# Altium schematic sheet DevKitSTM_r1.SchDoc
size A2; PageSetup: Record=PageOptions|CenterHorizontal=True|CenterVertical=True|PrintScale=0.52|XCorrection=1.00|YCorrection=1.00|PrintKind=1|BorderSize=5000000|LeftOffset=0|BottomOffset=0|Orientation=2|PaperLength=1000|PaperWidth=1000|Scale=100|PaperSource=7|PrintQuality=600|MediaType=1|DitherType=10|PaperKind=A4|PrintScaleMode=1
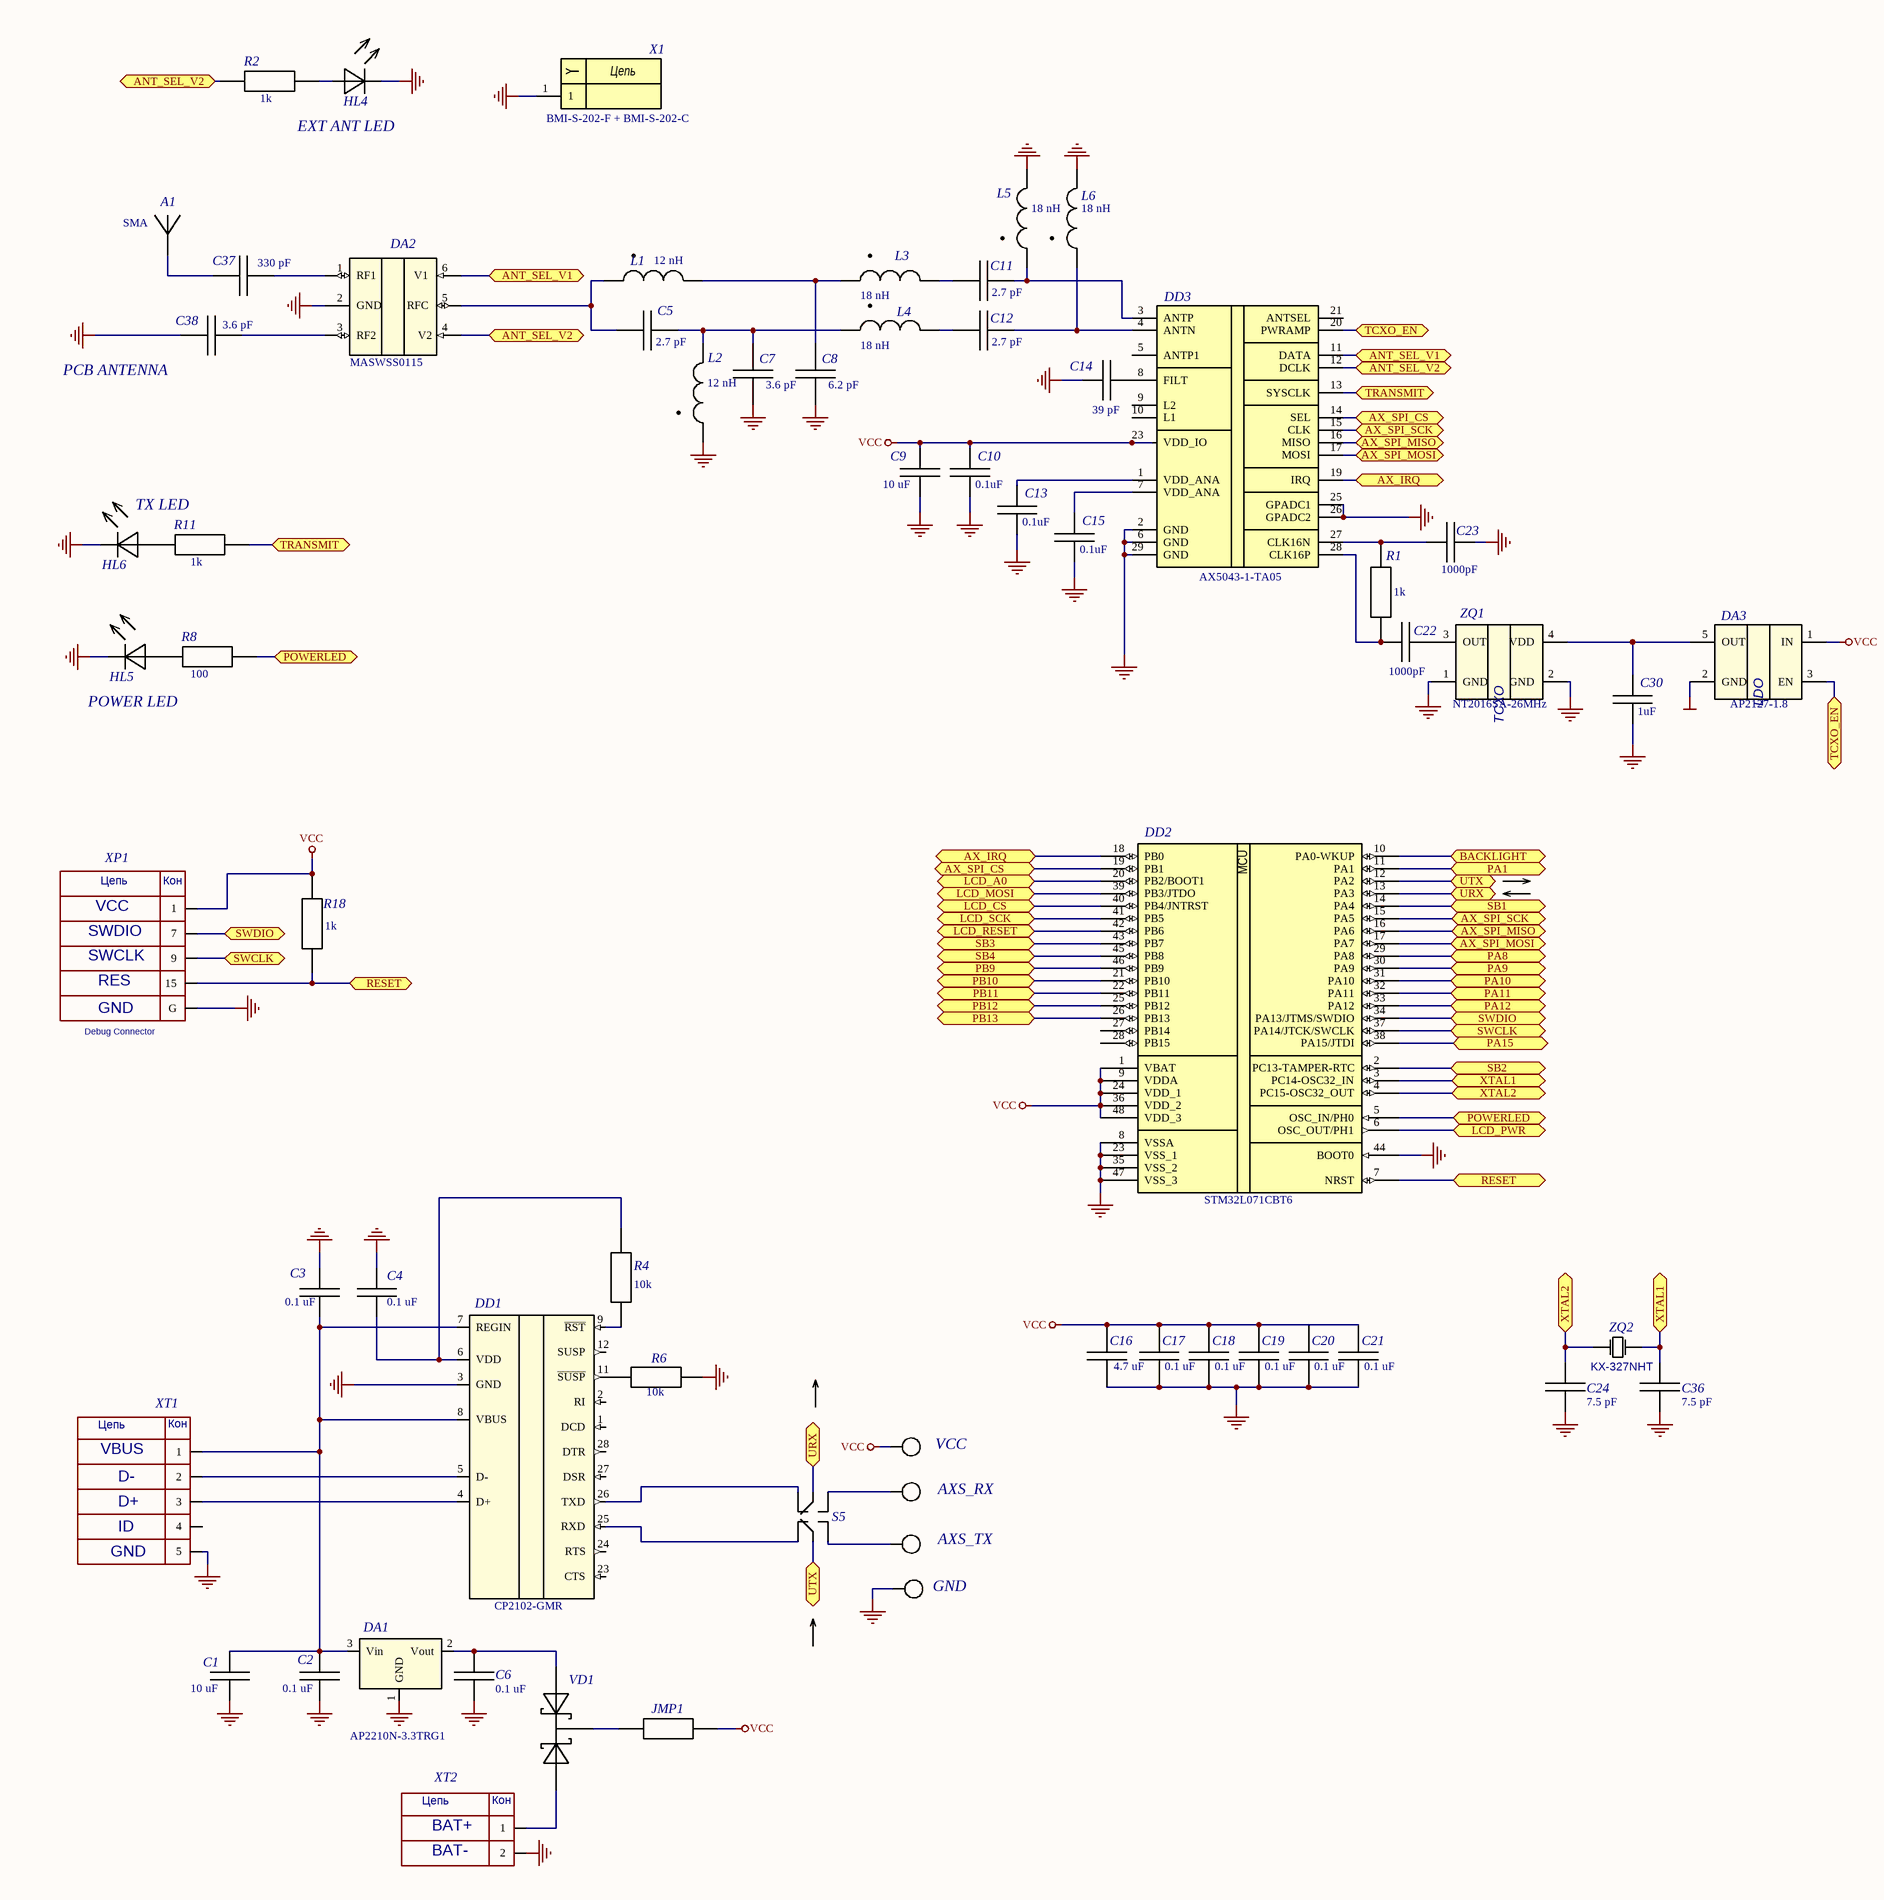
[diagram p0: DevKitSTM_r1.SchDoc, left]
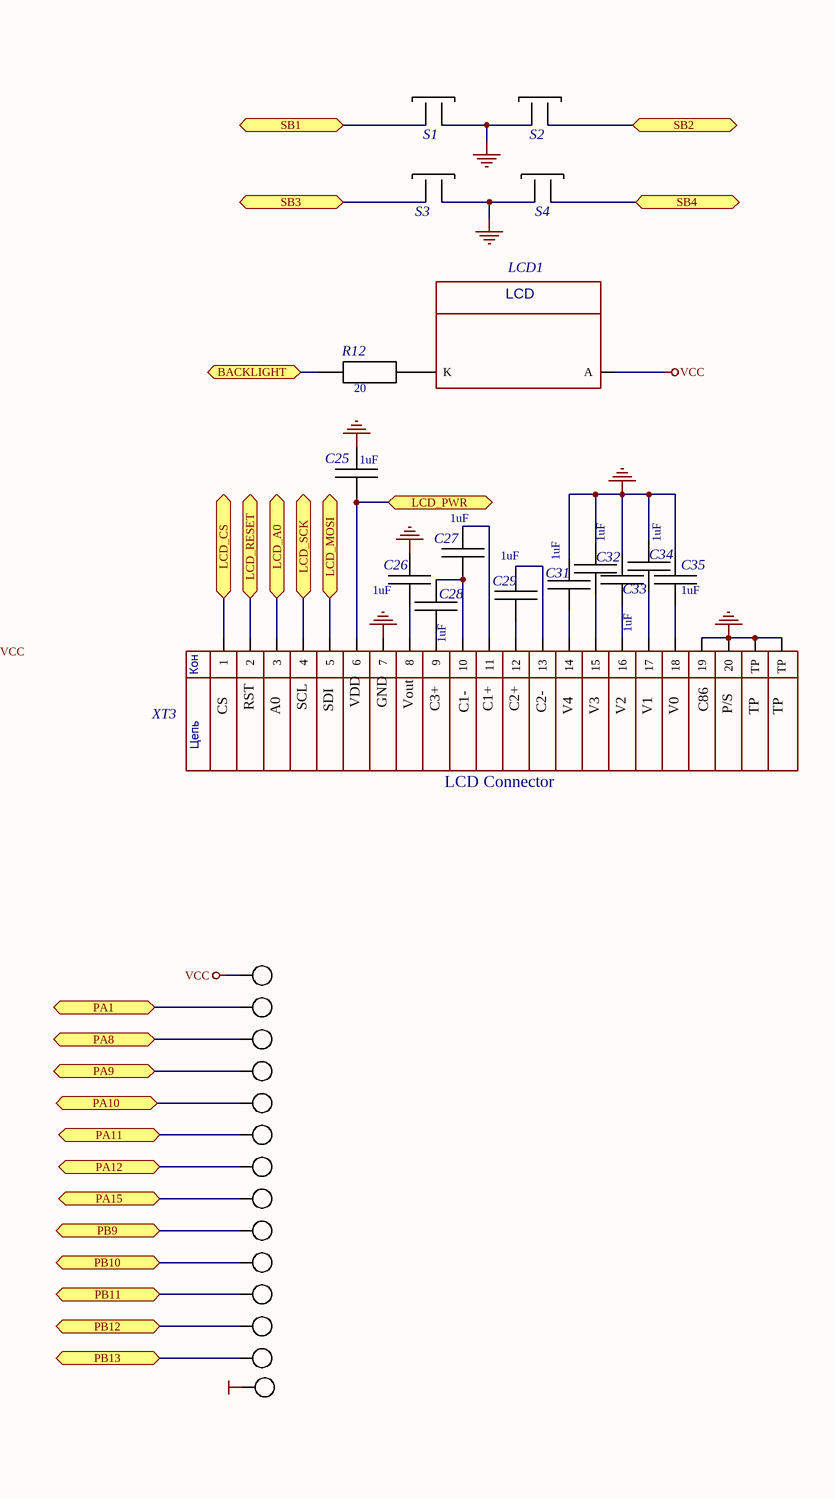
[diagram p1: DevKitSTM_r1.SchDoc, right]

## Parts
A1  SMA  [SMA_Str]  (net tie, no BOM)
C1  10 uF  [Cap_1206]
C2  0.1 uF  [Cap_0603]
C3  0.1 uF  [Cap_0603]
C4  0.1 uF  [Cap_0603]
C5  value 2.7 pF  [CAP_0603]
C6  0.1 uF  [Cap_0603]
C7  value 3.6 pF  [CAP_0603]
C8  value 6.2 pF  [CAP_0603]
C9  10 uF  [Cap_1206]
C10  0.1uF  [Cap_0603]
C11  value 2.7 pF  [CAP_0603]
C12  value 2.7 pF  [CAP_0603]
C13  0.1uF  [Cap_0603]
C14  39 pF  [Cap_0603]
C15  0.1uF  [Cap_0603]
C16  value 4.7 uF  [CAP_0603]
C17  value 0.1 uF  [CAP_0603]
C18  value 0.1 uF  [CAP_0603]
C19  value 0.1 uF  [CAP_0603]
C20  value 0.1 uF  [CAP_0603]
C21  value 0.1 uF  [CAP_0603]
C22  1000pF  [Cap_0603]
C23  1000pF  [Cap_0603]
C24  7.5 pF  [Cap_0603]
C25  1uF  [Cap_0603]
C26  1uF  [Cap_0603]
C27  1uF  [Cap_0603]
C28  1uF  [Cap_0603]
C29  1uF  [Cap_0603]
C30  1uF  [Cap_0603]
C31  1uF  [Cap_0603]
C32  1uF  [Cap_0603]
C33  1uF  [Cap_0603]
C34  1uF  [Cap_0603]
C35  1uF  [Cap_0603]
C36  7.5 pF  [Cap_0603]
C37  value 330 pF  [CAP_0603]
C38  value 3.6 pF  [CAP_0603]
DA1  PartNumber: AP2210N-3.3TRG1  [SOT23_L]  (hidden comment: AP2210)
DA2  MASWSS0115  [SC-70]
DA3  AP2127-1.8  [SOT23-5AN]
DD1  PartNumber: CP2102-GMR  [QFN28]  (hidden comment: CP2102)
DD2  STM32L071CBT6  [TSQFP50P900X900X160-48N]
DD3  AX5043-1-TA05  [QFN28]
HL4  LED_0603  [led0603]  (value not drawn)
HL5  LED_0603  [led0603]  (value not drawn)
HL6  LED_0603  [led0603]  (value not drawn)
JMP1  STD_RES  [JMP_PCB]  (value not drawn)  (no BOM)
L1  value 12 nH  [IND_0603]  (hidden comment: STD_IND)
L2  value 12 nH  [IND_0603]  (hidden comment: STD_IND)
L3  value 18 nH  [IND_0603]  (hidden comment: STD_IND)
L4  value 18 nH  [IND_0603]  (hidden comment: STD_IND)
L5  value 18 nH  [IND_0603]  (hidden comment: STD_IND)
L6  value 18 nH  [IND_0603]  (hidden comment: STD_IND)
LCD1  LCD_JHD  [LCD_JHD]  (value not drawn)
R1  1k  [RES_0603]
R2  1k  [RES_0603]
R4  10k  [RES_0603]
R6  10k  [RES_0603]
R8  100  [RES_0603]
R11  1k  [RES_0603]
R12  20  [RES_0603]
R18  1k  [RES_0603]
S1  SMD Button  [FSM_Button]  (value not drawn)  (no BOM)
S2  SMD Button  [FSM_Button]  (value not drawn)  (no BOM)
S3  SMD Button  [FSM_Button]  (value not drawn)  (no BOM)
S4  SMD Button  [FSM_Button]  (value not drawn)  (no BOM)
S5  CAS-220  [CAS-220]  (value not drawn)  (no BOM)
VD1  PMEG2005CT  [SOT23]  (value not drawn)
X1  PartNumber: BMI-S-202-F + BMI-S-202-C  [BMI-S-202-F]  (hidden comment: STD_CON1)
XP1  Debug Connector  [BH-20]
XP2  PLS-1  [HDR1X1]  (value not drawn)
XP3  PLS-1  [HDR1X1]  (value not drawn)
XP4  PLS-1  [HDR1X1]  (value not drawn)
XP5  PLS-1  [HDR1X1]  (value not drawn)
XP6  PLS-1  [HDR1X1]  (value not drawn)
XP7  PLS-1  [HDR1X1]  (value not drawn)
XP8  PLS-1  [HDR1X1]  (value not drawn)
XP10  PLS-1  [HDR1X1]  (value not drawn)
XP11  PLS-1  [HDR1X1]  (value not drawn)
XP13  PLS-1  [HDR1X1]  (value not drawn)
XP14  PLS-1  [HDR1X1]  (value not drawn)
XP15  PLS-1  [HDR1X1]  (value not drawn)
XP16  PLS-1  [HDR1X1]  (value not drawn)
XP17  PLS-1  [HDR1X1]  (value not drawn)
XP21  PLS-1  [HDR1X1]  (value not drawn)
XP22  PLS-1  [HDR1X1]  (value not drawn)
XP23  PLS-1  [HDR1X1]  (value not drawn)
XP24  PLS-1  [HDR1X1]  (value not drawn)
XT1  Molex_MINIUSB  [Molex_MINIUSB]  (value not drawn)
XT2  Molex053047  [Molex0533980271]  (value not drawn)
XT3  Molex0527462071  [Molex_0527462071]  (value not drawn)
ZQ1  NT2016SA-26MHz  [NT2016SA]
ZQ2  KX-327NHT  [KX-327NHT]

## Ports
ANT_SEL_V1, ANT_SEL_V2, AX_IRQ, AX_SPI_CS, AX_SPI_MISO, AX_SPI_MOSI, AX_SPI_SCK, BACKLIGHT, LCD_A0, LCD_CS, LCD_MOSI, LCD_PWR, LCD_RESET, LCD_SCK, PA1, PA8, PA9, PA10, PA11, PA12, PA15, PB9, PB10, PB11, PB12, PB13, POWERLED, RESET, SB1, SB2, SB3, SB4, SWCLK, SWDIO, TCXO_EN, TRANSMIT, URX, UTX, XTAL1, XTAL2

## Nets
GND: A1.2 C1.1 C2.2 C3.2 C6.2 C7.2 C8.2 C9.1 C10.1 C13.1 C14.1 C15.1 C16.2 C17.2 C18.2 C19.2 C20.2 C21.2 C23.2 C24.1 C25.2 C26.2 C30.1 C31.2 C32.2 C33.2 C34.2 C35.2 C36.1 C38.1 DA1.1(GND) DA2.2(GND) DA3.2(GND) DD2.8(VSSA) DD2.23(VSS_1) DD2.35(VSS_2) DD2.44(BOOT0) DD2.47(VSS_3) DD3.2(GND) DD3.6(GND) DD3.25(GPADC1) DD3.26(GPADC2) DD3.29(GND) HL4.C HL5.C HL6.C L2.1 L5.2 L6.2 S1.2 S2.2 S3.2 S4.2 X1.1 XP1.G XP17.1 XP24.1 XT1.5 XT2.2 XT3.7 XT3.19 XT3.20 XT3.21(TP) XT3.22(TP) ZQ1.1(GND) ZQ1.2(GND)
NetC4_2: C4.2 DD1.3(GND)
VCC: C9.2 C10.2 C16.1 C17.1 C18.1 C19.1 C20.1 C21.1 DA3.1(IN) DD2.1(VBAT) DD2.9(VDDA) DD2.24(VDD_1) DD2.36(VDD_2) DD2.48(VDD_3) DD3.23(VDD_IO) JMP1.2 LCD1.A R18.2 XP1.1 XP13.1 XP21.1
ANT_SEL_V1: DA2.6(V1) DD3.11(DATA) ; port ANT_SEL_V1
ANT_SEL_V2: DA2.4(V2) DD3.12(DCLK) R2.1 ; port ANT_SEL_V2
AX_IRQ: DD2.18(PB0) DD3.19(IRQ) ; port AX_IRQ
AX_SPI_CS: DD2.19(PB1) DD3.14(SEL) ; port AX_SPI_CS
AX_SPI_MISO: DD2.16(PA6) DD3.16(MISO) ; port AX_SPI_MISO
AX_SPI_MOSI: DD2.17(PA7) DD3.17(MOSI) ; port AX_SPI_MOSI
AX_SPI_SCK: DD2.15(PA5) DD3.15(CLK) ; port AX_SPI_SCK
BACKLIGHT: DD2.10(PA0-WKUP) R12.1 ; port BACKLIGHT
LCD_A0: DD2.20(PB2/BOOT1) XT3.3 ; port LCD_A0
LCD_CS: DD2.40(PB4/JNTRST) XT3.1 ; port LCD_CS
LCD_MOSI: DD2.39(PB3/JTDO) XT3.5 ; port LCD_MOSI
LCD_PWR: C25.1 DD2.6(OSC_OUT/PH1) XT3.6 ; port LCD_PWR
LCD_RESET: DD2.42(PB6) XT3.2 ; port LCD_RESET
LCD_SCK: DD2.41(PB5) XT3.4 ; port LCD_SCK
PA1: DD2.11(PA1) XP14.1 ; port PA1
PA8: DD2.29(PA8) XP10.1 ; port PA8
PA9: DD2.30(PA9) XP15.1 ; port PA9
PA10: DD2.31(PA10) XP11.1 ; port PA10
PA11: DD2.32(PA11) XP5.1 ; port PA11
PA12: DD2.33(PA12) XP6.1 ; port PA12
PA15: DD2.38(PA15/JTDI) XP7.1 ; port PA15
PB9: DD2.46(PB9) XP2.1 ; port PB9
PB10: DD2.21(PB10) XP3.1 ; port PB10
PB11: DD2.22(PB11) XP4.1 ; port PB11
PB12: DD2.25(PB12) XP8.1 ; port PB12
PB13: DD2.26(PB13) XP16.1 ; port PB13
POWERLED: DD2.5(OSC_IN/PH0) R8.1 ; port POWERLED
RESET: DD2.7(NRST) R18.1 XP1.15 ; port RESET
SB1: DD2.14(PA4) S1.1 ; port SB1
SB2: DD2.2(PC13-TAMPER-RTC) S2.1 ; port SB2
SB3: DD2.43(PB7) S3.1 ; port SB3
SB4: DD2.45(PB8) S4.1 ; port SB4
SWCLK: DD2.37(PA14/JTCK/SWCLK) XP1.9 ; port SWCLK
SWDIO: DD2.34(PA13/JTMS/SWDIO) XP1.7 ; port SWDIO
TCXO_EN: DA3.3(EN) DD3.20(PWRAMP) ; port TCXO_EN
TRANSMIT: DD3.13(SYSCLK) R11.1 ; port TRANSMIT
URX: DD2.13(PA3) S5.2 ; port URX
UTX: DD2.12(PA2) S5.5 ; port UTX
XTAL1: C36.2 DD2.3(PC14-OSC32_IN) ZQ2.1 ; port XTAL1
XTAL2: C24.2 DD2.4(PC15-OSC32_OUT) ZQ2.2 ; port XTAL2
NetA1_1: A1.1 C37.1
NetC1_2: C1.2 C2.1 C3.1 DA1.3(Vin) DD1.7(REGIN) DD1.8(VBUS) XT1.1
NetC4_1: C4.1 DD1.6(VDD) R4.2
NetC5_1: C5.1 DA2.5(RFC) L1.1
NetC5_2: C5.2 C7.1 L2.2 L4.1
NetC6_1: C6.1 DA1.2(Vout) VD1.2(A)
NetC8_1: C8.1 L1.2 L3.1
NetC11_1: C11.1 L3.2
NetC11_2: C11.2 DD3.3(ANTP) L5.1
NetC12_1: C12.1 L4.2
NetC12_2: C12.2 DD3.4(ANTN) L6.1
NetC13_2: C13.2 DD3.1(VDD_ANA)
NetC14_2: C14.2 DD3.8(FILT)
NetC15_2: C15.2 DD3.7(VDD_ANA)
NetC22_1: C22.1 DD3.28(CLK16P) R1.1
NetC22_2: C22.2 ZQ1.3(OUT)
NetC23_1: C23.1 DD3.27(CLK16N) R1.2
NetC26_1: C26.1 XT3.8
NetC27_1: C27.1 XT3.11
NetC27_2: C27.2 C28.2 XT3.10
NetC28_1: C28.1 XT3.9
NetC29_1: C29.1 XT3.12
NetC29_2: C29.2 XT3.13
NetC30_2: C30.2 DA3.5(OUT) ZQ1.4(VDD)
NetC31_1: C31.1 XT3.14
NetC32_1: C32.1 XT3.15
NetC33_1: C33.1 XT3.16
NetC34_1: C34.1 XT3.17
NetC35_1: C35.1 XT3.18
NetC37_2: C37.2 DA2.1(RF1)
NetC38_2: C38.2 DA2.3(RF2)
NetDD1_4: DD1.4(D+) XT1.3
NetDD1_5: DD1.5(D-) XT1.2
NetDD1_9: DD1.9(~{RST}) R4.1
NetDD1_11: DD1.11(~{SUSP}) R6.2
NetDD1_25: DD1.25(RXD) S5.6
NetDD1_26: DD1.26(TXD) S5.3
NetHL4_A: HL4.A R2.2
NetHL5_A: HL5.A R8.2
NetHL6_A: HL6.A R11.2
NetJMP1_1: JMP1.1 VD1.3(C)
NetLCD1_K: LCD1.K R12.2
NetS5_1: S5.1 XP22.1
NetS5_4: S5.4 XP23.1
NetVD1_1: VD1.1(A) XT2.1

Not connected (* = marked no-connect by the designer): DD1 1(DCD) 2(RI) 12(SUSP) 23(CTS) 24(RTS) 27(DSR) 28(DTR); DD2 27(PB14) 28(PB15); DD3 5(ANTP1) 9(L2) 10(L1) 21(ANTSEL); R6 1; XT1 4

## Notes on the sheet
- EXT ANT LED
- PCB ANTENNA
- TX LED
- POWER LED
- CS
- RST
- A0
- SCL
- SDI
- VDD
- GND
- Vout
- C3+
- C1-
- C1+
- C2+
- C2-
- V4
- V3
- V2
- V1
- V0
- C86
- P/S
- TP
- LCD Connector
- VCC
- AXS_RX
- (near XP24) GND
- AXS_TX
- (near XT2) BAT+
- (near XT2) BAT-
- Labels drawn without touching a wire or pin: GND
- (in symbol AP2127) LDO
- (in symbol BMI-S-202-F) Цепь
- (in symbol JTAG_BH20) Цепь; Кон; VCC; SWDIO; SWCLK; RES; GND
- (in symbol LCD_JHD) LCD
- (in symbol Molex053047) Цепь; Кон
- (in symbol Molex0527462071) Кон; Цепь
- (in symbol Molex_MINIUSB) Цепь; Кон; VBUS; D-; D+; ID; GND
- (in symbol NT2016) TCXO
- (in symbol STM32_LQFP48) MCU

## Library data of the parts
A1 = SMA_Str: CONN SMA JACK STR 50 OHM PCB; PartNumber: 5-1814832-1
C1 C9 = Cap 1206: CAP CER 10UF 16V Y5V 1206; PartNumber: CL31F106ZOHNNNE; Dezigner: Kharlamov M V; Code Value: code of resistance marked on chip; Power/Voltage: *; ManufacturerPartNumber: *; Package: =Footprint; ComponentLink1URL: D:\second_datasheet.pdf; ComponentLink2Description: third datasheet description; ComponentLink2URL: Z:\third_datasheet.pdf; Publisher: MDB Kompas; ModelName: *; Value: 10 uF
C2-C4 C6 C10 C13 C15 = Cap 0603: CAP CER 0603 0.1 uF 16 V 10% X7R; PartNumber: CC0603KRX7R7BB104; BSPId: ГОСТ 2.728-74 УГО конденсаторы; Dezigner: Kharlamov M V; Code Value: code of resistance marked on chip; Note: Ваши примечания; Power/Voltage: *; Tolerance: *; Manufacturer: *; ManufacturerPartNumber: *; Package: =Footprint; HELPURL: C:\Datasheet\Capasitors\K73.pdf; ComponentLink1URL: D:\second_datasheet.pdf; ComponentLink1Description: second datasheet description; ComponentLink2Description: third datasheet description; ComponentLink2URL: Z:\third_datasheet.pdf; Published: 21.07.2008; Publisher: MDB Kompas; ModelName: *
  C2-C4 C6: Value: 0.1 uF
  C10 C13 C15: Value: 0.1uF
C5 C11 C12 = GRM1885C1H2R7CA01D: CAP CER 2.7PF 50V NPO 0603; PartNumber: CC0603BRNPO9BN2R7; Manufacturer: MURATA; ID: 176; Tolerance: +/- 0.25 пФ; Напряжение: 50 В; Температура: -55...+85°C; Autor: Admin; Type: CHIP-0603; Диэлектрик: NPO; Data: 04-15-2016
C7 C38 = CL10C3R6CB8NNNC: CAP CER 3.6PF 50V NPO 0603; PartNumber: CC0603BRNPO9BN3R6; Manufacturer: Samsung; ID: 177; Tolerance: +/- 0.25 пФ; Напряжение: 50 В; Температура: -55...+85°C; Autor: Admin; Type: CHIP-0603; Диэлектрик: NPO; Data: 04-15-2016
C8 = CL10C6R2CB8NNNC: CAP CER 6.2PF 50V NPO 0603; Manufacturer: Samsung; ID: 178; Tolerance: +/- 0.25 пФ; Напряжение: 50 В; Температура: -55...+85°C; Autor: Admin; PartNumber: CL10C6R2CB8NNNC; Type: CHIP-0603; Диэлектрик: NPO; Data: 04-15-2016
C14 = Cap 0603: CAP CER 39PF 50V C0G/NPO 0603; PartNumber: CC0603JRNPO9BN390; BSPId: ГОСТ 2.728-74 УГО конденсаторы; Dezigner: Kharlamov M V; Code Value: code of resistance marked on chip; Note: Ваши примечания; Power/Voltage: *; Tolerance: *; Manufacturer: *; ManufacturerPartNumber: *; Package: =Footprint; HELPURL: C:\Datasheet\Capasitors\K73.pdf; ComponentLink1URL: D:\second_datasheet.pdf; ComponentLink1Description: second datasheet description; ComponentLink2Description: third datasheet description; ComponentLink2URL: Z:\third_datasheet.pdf; Published: 21.07.2008; Publisher: MDB Kompas; ModelName: *; Value: 39 pF
C16 = CC0603KRX5R6BB475: CAP CER 0603 4.7 uF 10 V 10% X5R; Manufacturer: YAGEO; ID: 71; Напряжение: 10 В; Температура: -55...+85°C; Autor: Цислав А.Н.; PartNumber: CC0603KRX5R6BB475; Type: CHIP-0603; Tolerance: 10%; Диэлектрик: X5R; Data: 09-05-2013
C17-C21 = CC0603KRX7R7BB104: CAP CER 0603 0.1 uF 16 V 10% X7R; Manufacturer: YAGEO; ID: 27; Напряжение: 16 В; Температура: -55...+85°C; Autor: Admin; PartNumber: CC0603KRX7R7BB104; Type: CHIP-0603; Tolerance: 10%; Диэлектрик: X7R; Data: 08-29-2013
C22 C23 = Cap 0603: CAP CER 1000PF 50V X7R 0603; PartNumber: CC0603KRX7R9BB102; BSPId: ГОСТ 2.728-74 УГО конденсаторы; Dezigner: Kharlamov M V; Code Value: code of resistance marked on chip; Note: Ваши примечания; Power/Voltage: *; Tolerance: *; Manufacturer: *; ManufacturerPartNumber: *; Package: =Footprint; HELPURL: C:\Datasheet\Capasitors\K73.pdf; ComponentLink1URL: D:\second_datasheet.pdf; ComponentLink1Description: second datasheet description; ComponentLink2Description: third datasheet description; ComponentLink2URL: Z:\third_datasheet.pdf; Published: 21.07.2008; Publisher: MDB Kompas; ModelName: *; Value: 1000pF
C24 C36 = Cap 0603: CAP CER 7.5PF 50V NPO 0603; PartNumber: CC0603CRNPO9BN7R5; BSPId: ГОСТ 2.728-74 УГО конденсаторы; Dezigner: Kharlamov M V; Code Value: code of resistance marked on chip; Note: Ваши примечания; Power/Voltage: *; Tolerance: *; Manufacturer: *; ManufacturerPartNumber: *; Package: =Footprint; HELPURL: C:\Datasheet\Capasitors\K73.pdf; ComponentLink1URL: D:\second_datasheet.pdf; ComponentLink1Description: second datasheet description; ComponentLink2Description: third datasheet description; ComponentLink2URL: Z:\third_datasheet.pdf; Published: 21.07.2008; Publisher: MDB Kompas; ModelName: *; Value: 7.5 pF
C25-C29 C31-C35 = Cap 0805: CAP CER 1UF 16V X7R 0603; PartNumber: CC0603KRX7R7BB105; Dezigner: Kharlamov M V; Code Value: code of resistance marked on chip; Power/Voltage: *; ManufacturerPartNumber: *; Package: =Footprint; ComponentLink1URL: D:\second_datasheet.pdf; ComponentLink2Description: third datasheet description; ComponentLink2URL: Z:\third_datasheet.pdf; Publisher: MDB Kompas; ModelName: *
C30 = Cap 0603: CAP CER 1UF 16V X7R 0603; PartNumber: CC0603KRX7R7BB105; BSPId: ГОСТ 2.728-74 УГО конденсаторы; Dezigner: Kharlamov M V; Code Value: code of resistance marked on chip; Note: Ваши примечания; Power/Voltage: *; Tolerance: *; Manufacturer: *; ManufacturerPartNumber: *; Package: =Footprint; HELPURL: C:\Datasheet\Capasitors\K73.pdf; ComponentLink1URL: D:\second_datasheet.pdf; ComponentLink1Description: second datasheet description; ComponentLink2Description: third datasheet description; ComponentLink2URL: Z:\third_datasheet.pdf; Published: 21.07.2008; Publisher: MDB Kompas; ModelName: *; Value: 1uF
C37 = GRM1885C1H2R7CA01D: CAP CER 330PF 50V NPO 0603; PartNumber: CC0603JRNPO9BN331; Manufacturer: MURATA; ID: 176; Tolerance: +/- 0.25 пФ; Напряжение: 50 В; Температура: -55...+85°C; Autor: Admin; Type: CHIP-0603; Диэлектрик: NPO; Data: 04-15-2016
DA1 = AP2210: IC REG LDO 3.3V 0.3A SOT23; Comment_1: TPS61040
DA2 = MASWSS0115: GaAs SPDT Switch  DC - 3.0 GHz; PartNumber: MASWSS0115TR-3000
DA3 = AP2127: IC REG LINEAR 1.8V 300MA SOT23-5; PartNumber: AP2127K-1.8TRG1; Comment_1: TPS61040
DD1 = CP2102: IC USB-TO-UART BRIDGE 28VQFN; Published: 16-Jan-2001; LatestRevisionDate: 13-Apr-2006; LatestRevisionNote: IPC-7351 Footprint Added.; DatasheetVersion: Feb-1996; PackageReference: NSO8; Publisher: Altium Limited; PackageDescription: 8-Pin Small Outline Integrated Circuit 1.27 mm Pitch; Code_JEDEC: MS-012-AA; Code_IPC: SOIC127P600-8; ComponentLink1Description: Manufacturer Link; ComponentLink1URL: http://www.maxim-ic.com/; ComponentLink2Description: Datasheet; ComponentLink2URL: http://pdfserv.maxim-ic.com/en/ds/MAX1487-MAX491.pdf
DD2 = STM32_LQFP48: IC MCU 32BIT 128KB FLASH 48LQFP; Manufacturer: STMicroelectronics; Core Processor: ARM® Cortex®-M0+; Core Size: 32-Bit; Speed: 32MHz; Connectivity: I²C, IrDA, SPI, UART/USART; Peripherals: Brown-out Detect/Reset, DMA, POR, PWM, WDT; Number of I/O: 37; Program Memory Size: 128KB (128K x 8); EEPROM Size: 6K x 8; RAM Size: 20K x 8; Voltage - Supply (Vcc/Vdd): 1.65 V ~ 3.6 V; Data Converters: A/D 13x12b; Oscillator Type: Internal; PartNumber: STM32L071CBT6; Digi-Key Part Number: STM32L071CBT6-ND; Packaging: Tray; Series: STM32 L0; Part Status: Active; Program Memory Type: FLASH; Operating Temperature: -40°C ~ 85°C (TA); Package / Case: 48-LQFP; Supplier Device Package: 48-LQFP; ComponentLink1URL: http://www.st.com/content/ccc/resource/technical/document/datasheet/b5/24/80/11/51/59/47/f7/DM00141136.pdf/files/DM00141136.pdf/jcr:content/translations/en.DM00141136.pdf; ComponentLink1Description: Datasheet
DD3 = AX5043: IC AXSEM RF Tranceiver; ComponentLink1URL: b:\Altium\Libs\Pdf\Axem\AX5043-D.PDF; ComponentLink1Description: Datasheet; PartNumber: AX5043-1-TA05; ComponentLink3URL: b:\Altium\Libs\Pdf\Axem\AX5043 Use with a TCXO Reference Clock.PDF; ComponentLink3Description: AX5043 Use with a TCXO Reference Clock; ComponentLink2Description: Programming manual; ComponentLink2URL: b:\Altium\Libs\Pdf\Axem\Programming manual.PDF
HL4 = LED_0603: LED GREEN CLEAR 0603 SMD; PartNumber: APT1608CGCK
HL5 = LED_0603: LED 527NM BLU/GRN TRANSP RA SMD; PartNumber: SMLE13EC8TT86
HL6 = LED_0603: LED 1.6X0.8MM 630NM RED CLR SMD; PartNumber: APT1608SURCK
JMP1 = JMP_PCB: NoName  PCB Jumper; ID: 46; Температура: -40...+85°C; Autor: Admin; PartNumber: JMP_PCB; Type: Debug; Value: PCB Jumper; Manufacturer: NoName; Data: 06-16-2016
L1 = LQW18AN12NG00: FIXED IND 18NH 650MA 160 MOHM; Manufacturer: MURATA; ID: 105; Type: CHIP-0603_RF; Tolerance: 2%; Current: 650 мА; Температура: -40...+85°C; Autor: Цислав А.Н.; PartNumber: LQW18AN12NG00; Data: 01-14-2015
L2 = LQW18AN12NG00: FIXED IND 12NH 650MA 160 MOHM; Manufacturer: MURATA; ID: 105; Type: CHIP-0603_RF; Tolerance: 2%; Current: 650 мА; Температура: -40...+85°C; Autor: Цислав А.Н.; PartNumber: LQW18AN12NG00; Data: 01-14-2015
L3-L6 = LQW18AN18NG00: FIXED IND 18NH 550MA 160 MOHM; Manufacturer: MURATA; ID: 87; Type: CHIP-0603_RF; Tolerance: 2%; Current: 500 мА; Температура: -40...+85°C; Autor: Цислав А.Н.; PartNumber: LQW18AN18NG00; Data: 01-14-2015
LCD1 = LCD_JHD: LCD Display; PartNumber: JHD12864
R1 R2 R11 R18 = Res 0603: RES SMD 1K OHM 1% 1/10W 0603; PartNumber: RC1608F102CS; BSPId: ГОСТ 2.728-74 УГО резисторы; Note: Ваши примечания; Dezigner: Kharlamov M V; ModelName: RESC1005X04L (0402); Code Value: code of resistance marked on chip; Power/Voltage: *; Tolerance: *; Manufacturer: *; ManufacturerPartNumber: *; Package: =Footprint; HELPURL: C:\Datasheet\Resistors\rezistors.pdf; ComponentLink1URL: D:\second_datasheet.pdf; ComponentLink1Description: second datasheet description; ComponentLink2Description: third datasheet description; ComponentLink2URL: Z:\third_datasheet.pdf; Published: 21.07.2008; Publisher: MDB Kompas; Value: *
R4 R6 = Res 0603: RES SMD 10 KOHM 1% 1/10W 0603; PartNumber: RC1608F103CS; BSPId: ГОСТ 2.728-74 УГО резисторы; Note: Ваши примечания; Dezigner: Kharlamov M V; ModelName: RESC1005X04L (0402); Code Value: code of resistance marked on chip; Power/Voltage: *; Tolerance: *; Manufacturer: *; ManufacturerPartNumber: *; Package: =Footprint; HELPURL: C:\Datasheet\Resistors\rezistors.pdf; ComponentLink1URL: D:\second_datasheet.pdf; ComponentLink1Description: second datasheet description; ComponentLink2Description: third datasheet description; ComponentLink2URL: Z:\third_datasheet.pdf; Published: 21.07.2008; Publisher: MDB Kompas; Value: *
R8 = Res 0603: RES SMD 100 OHM 1% 1/10W 0603; PartNumber: RC1608J101CS; BSPId: ГОСТ 2.728-74 УГО резисторы; Note: Ваши примечания; Dezigner: Kharlamov M V; ModelName: RESC1005X04L (0402); Code Value: code of resistance marked on chip; Power/Voltage: *; Tolerance: *; Manufacturer: *; ManufacturerPartNumber: *; Package: =Footprint; HELPURL: C:\Datasheet\Resistors\rezistors.pdf; ComponentLink1URL: D:\second_datasheet.pdf; ComponentLink1Description: second datasheet description; ComponentLink2Description: third datasheet description; ComponentLink2URL: Z:\third_datasheet.pdf; Published: 21.07.2008; Publisher: MDB Kompas; Value: *
R12 = Res 0805: RES SMD 20 OHM 1% 1/10W 0603; PartNumber: RC1608F200CS; BSPId: ГОСТ 2.728-74 УГО резисторы; Note: Ваши примечания; Dezigner: Kharlamov M V; ModelName: RESC1005X04L (0402); Code Value: code of resistance marked on chip; Power/Voltage: *; Tolerance: *; Manufacturer: *; ManufacturerPartNumber: *; Package: =Footprint; HELPURL: C:\Datasheet\Resistors\rezistors.pdf; ComponentLink1URL: D:\second_datasheet.pdf; ComponentLink1Description: second datasheet description; ComponentLink2Description: third datasheet description; ComponentLink2URL: Z:\third_datasheet.pdf; Published: 21.07.2008; Publisher: MDB Kompas; Value: *
S1-S4 = SMD Button: SWITCH TACTILE SPST-NO 0.05A 24V; PartNumber: FSM4JSMATR
S5 = CAS-220: SLIDE SWITCH DPDT GULLWING 6V; PartNumber: CAS-220TB
VD1 = PMEG2005CT: DIODE ARRAY SCHOTTKY 20V SOT23; Manufacturer: NXP; ID: 31; Type: Diode Schottky; U_direct: 500 мВ; U_reverse: 20 В; Current: 500 мА; Температура: -40...+85°C; Autor: Admin; PartNumber: PMEG2005CT; Data: 08-27-2015
X1 = BMI-S-202-F: BOARD SHIELD .65X.65" FRAME + COVER; Manufacturer: Liard; ID: 46; Contact: 1; Autor: Цислав А.Н.; Type: Shield; Mounting: Поверхностный; Data: 10-24-2014
XP1 = JTAG_BH20: CONN 2 RAWS 20 PINS 2.54 PITCH; PartNumber: BH-20
XT1 = Molex_MINIUSB: CONN RECEPT MINIUSB R/A 5POS SMD; PartNumber: 548190572
XT2 = Molex053047: CONN HEADER 2POS 1.25MM VERT SMD; PartNumber: 533980271
XT3 = Molex0527462071: 20-pin LCD connector; PartNumber: CONN_FOR_JHD12864
ZQ1 = NT2016: Quartz Crystal Controlled Oscillator; PartNumber: NT2016SA-26.000000MHZ-NBG2; Comment_1: TPS61040
ZQ2 = KX-327NHT: Geyer  Quartz Crystal; Part Manufacturer: GEYER ELECTRONIC; PartNumber: KX-327NHT; Component Type: Кварцевый резонатор; Pin Count: 2; ComponentLink1URL: http://www.geyer-electronic.com/uploads/tx_userartikelfrequenz/GEYER-KX-327NHT_08.pdf; ComponentLink1Description: Datasheet